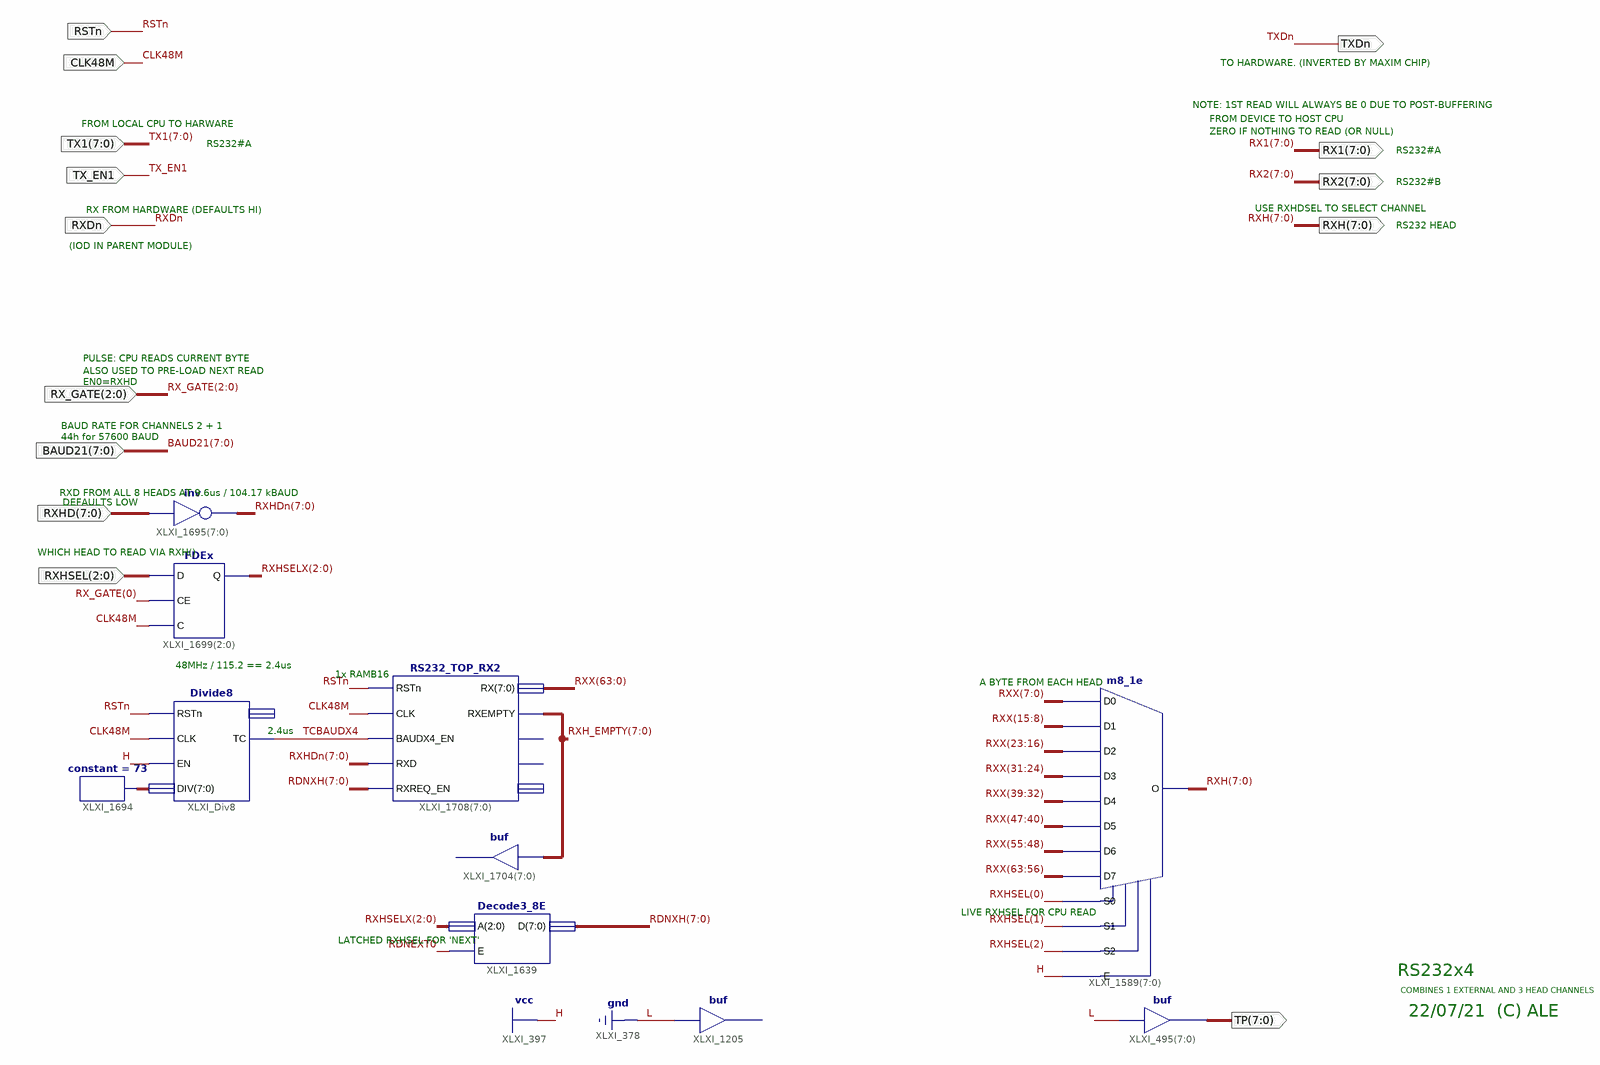
[diagram p0: schematic sheet 1]
// Xilinx ISE schematic RS232x4.sch (spartan3e) as structural Verilog: 10 symbols, 14 ports
module RS232x4 (
  input  CLK48M,
  input  RSTn,
  input  [7:0] TX1,
  input  [2:0] RX_GATE,
  input  [7:0] BAUD21,
  input  [2:0] RXHSEL,
  input  [7:0] RXHD,
  input  TX_EN1,
  input  RXDn,
  output TXDn,
  output [7:0] RX1,
  output [7:0] RX2,
  output [7:0] RXH,
  output [7:0] TP
);

  wire RDNEXT0, TCBAUDX4;
  wire [2:0] RXHSELX;
  wire [7:0] RDNXH, RXH_EMPTY, RXHDn, XLXN_2253;
  wire [63:0] RXX;

  assign TP = {8{1'b0}};  // buf XLXI_495[7..0], 8 bits wide
  Divide8 XLXI_Div8 (.CLK(CLK48M), .DIV(XLXN_2253), .EN(1'b1), .RSTn(RSTn), .TC(TCBAUDX4));  // open: CUP
  m8_1e XLXI_1589[7:0] (
    .D0(RXX[7:0]), .D1(RXX[15:8]), .D2(RXX[23:16]), .D3(RXX[31:24]), .D4(RXX[39:32]), .D5(RXX[47:40]),
    .D6(RXX[55:48]), .D7(RXX[63:56]), .E(1'b1), .S0(RXHSEL[0]), .S1(RXHSEL[1]), .S2(RXHSEL[2]), .O(RXH));
  constant #(.CValue("73")) XLXI_1694 (.O(XLXN_2253));
  Decode3_8E XLXI_1639 (.A(RXHSELX), .D(RDNXH), .E(RDNEXT0));
  FDEx XLXI_1699[2:0] (.C(CLK48M), .CE(RX_GATE[0]), .D(RXHSEL), .Q(RXHSELX));
  assign RXHDn = ~RXHD;  // inv XLXI_1695[7..0], 8 bits wide
  // buf XLXI_1205 has open pins: I=1'b0, O=open
  // buf XLXI_1704[7..0] has open pins: I=RXH_EMPTY, O=open
  RS232_TOP_RX2 XLXI_1708[7:0] (
    .BAUDX4_EN(TCBAUDX4), .CLK(CLK48M), .RSTn(RSTn), .RX(RXX), .RXD(RXHDn), .RXEMPTY(RXH_EMPTY),
    .RXREQ_EN(RDNXH));  // open: RXERR, RXFULL, TP

  // Notes on the sheet:
  //   TO HARDWARE. (INVERTED BY MAXIM CHIP)
  //   NOTE: 1ST READ WILL ALWAYS BE 0 DUE TO POST-BUFFERING
  //   FROM DEVICE TO HOST CPU
  //   FROM LOCAL CPU TO HARWARE
  //   ZERO IF NOTHING TO READ (OR NULL)
  //   RS232#A
  //   RS232#A
  //   RS232#B
  //   USE RXHDSEL TO SELECT CHANNEL
  //   RX FROM HARDWARE (DEFAULTS HI)
  //   RS232 HEAD
  //   (IOD IN PARENT MODULE)
  //   PULSE: CPU READS CURRENT BYTE
  //   ALSO USED TO PRE-LOAD NEXT READ
  //   EN0=RXHD
  //   BAUD RATE FOR CHANNELS 2 + 1
  //   44h for 57600 BAUD
  //   RXD FROM ALL 8 HEADS AT 9.6us / 104.17 kBAUD
  //   DEFAULTS LOW
  //   WHICH HEAD TO READ VIA RXH()
  //   48MHz / 115.2 == 2.4us
  //   1x RAMB16
  //   A BYTE FROM EACH HEAD
  //   2.4us
  //   LIVE RXHSEL FOR CPU READ
  //   LATCHED RXHSEL FOR 'NEXT'
  //   RS232x4
  //   COMBINES 1 EXTERNAL AND 3 HEAD CHANNELS
  //   22/07/21  (C) ALE
endmodule
